# EAGLE board driver_board (EAGLE 6.1)
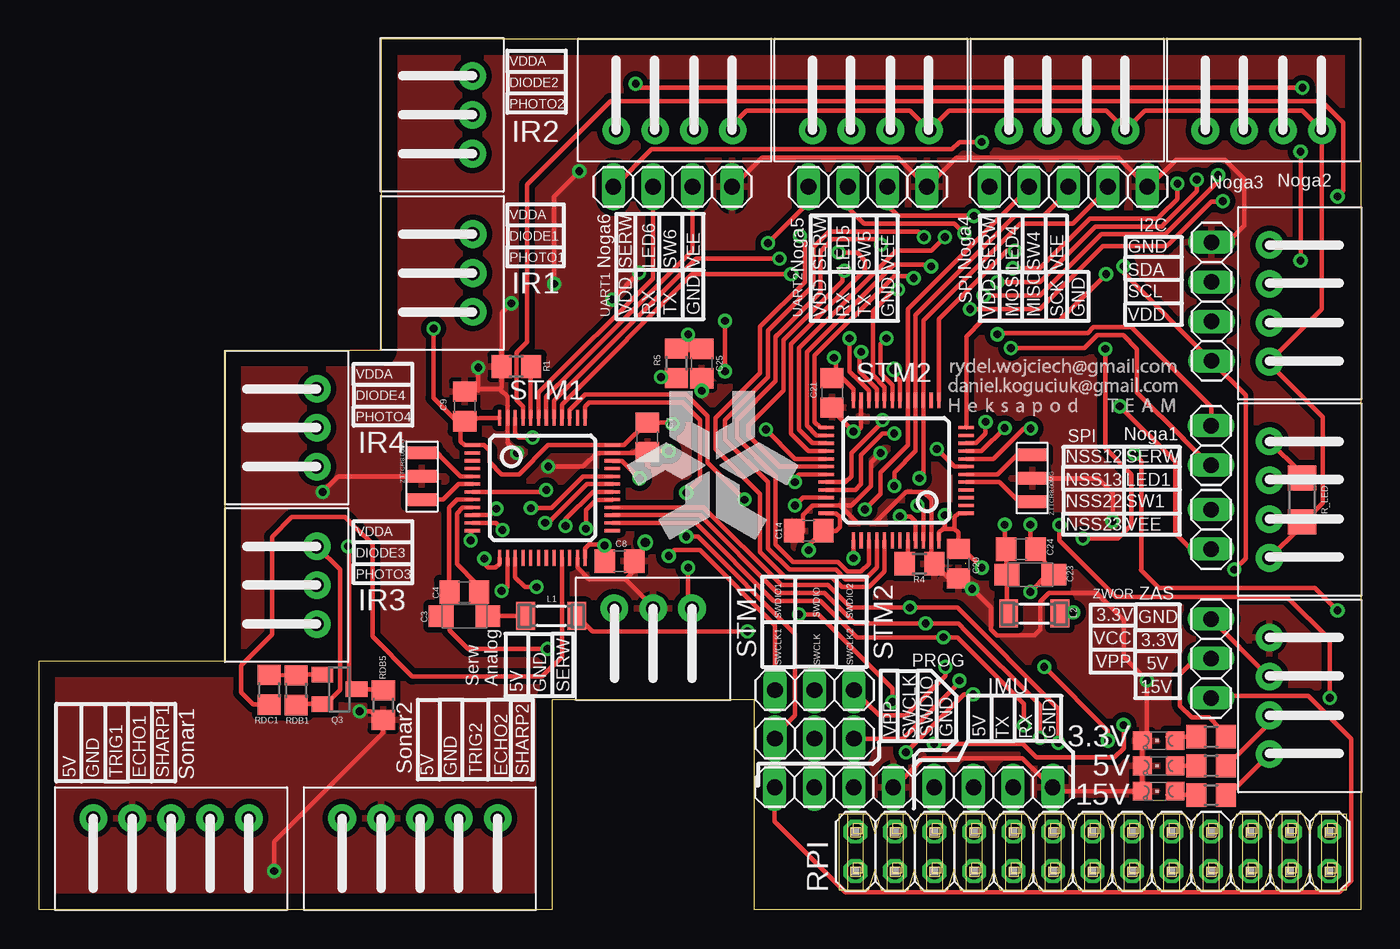
[diagram p7: board, top side]
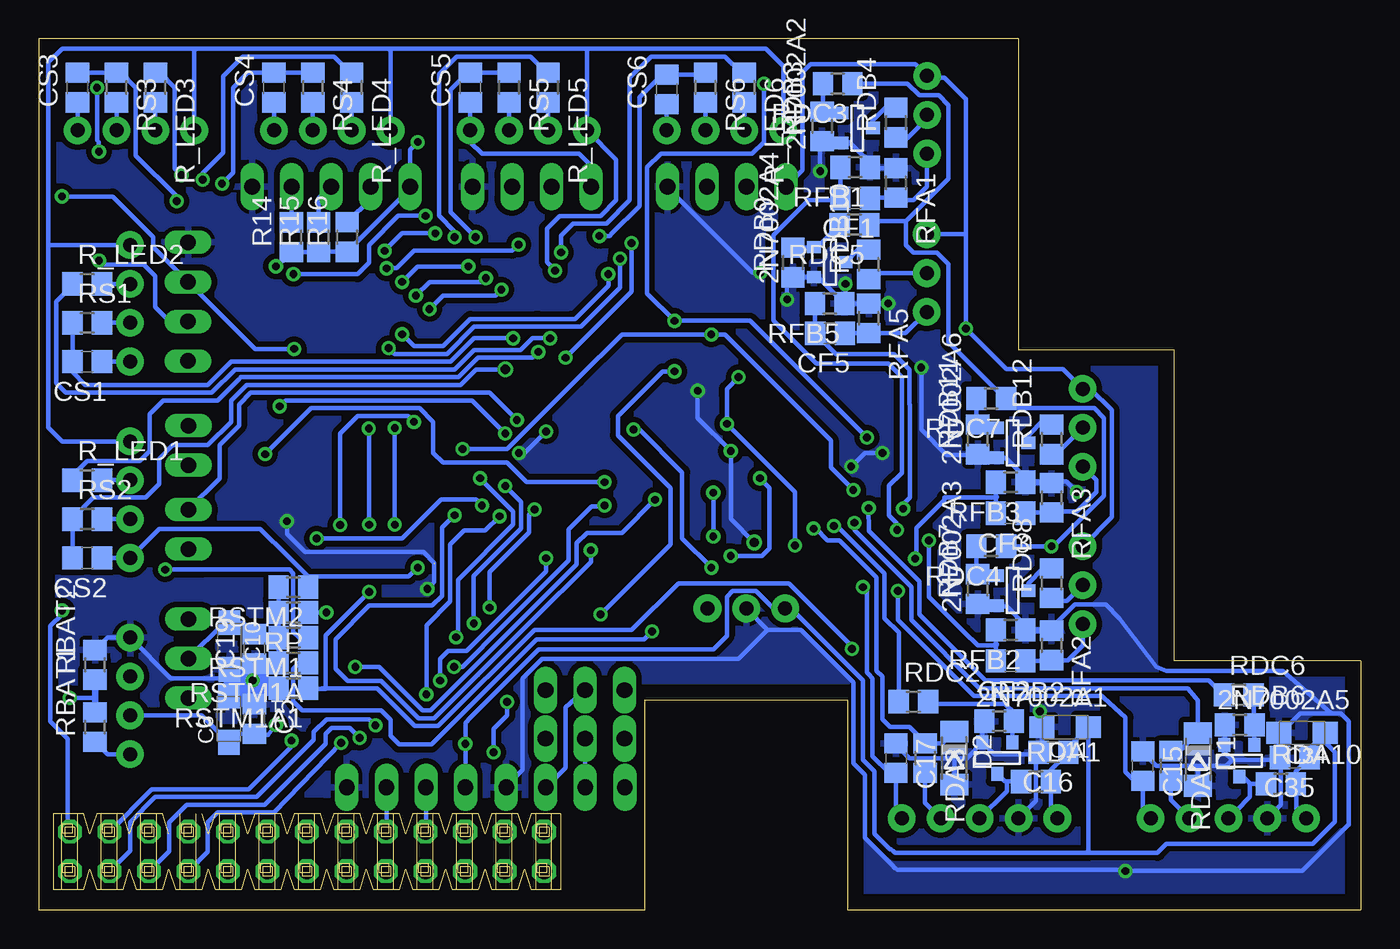
[diagram p8: board, bottom side, seen from below]

Size 84.99 x 56.01 mm. Coordinates in mm from the lower left corner, seen from the top.
Outline: 320 segments
Copper layers (1*16): Top 0.035mm / dielectric 1.5mm / Bottom 0.035mm
Design rules: minimum track width 10mil, minimum drill 24mil, track to track 10mil, track to pad 10mil, pad to pad 10mil, via to via 10mil, smd to smd 0mil, copper to edge 40mil, drill to drill 8mil, minimum pad ring 10mil, minimum via ring 8mil, stop-mask expansion 4mil, vias tented up to drill 0mil, thermal gap 10mil

## Footprints (pad centres in the part's own frame; a part is rotated, then mirrored left to right if it is on the bottom)
SOT-23 = smd 0.787 x 0.889: 1 0.025,-1.016; 2 -0.94,1.016; 3 0.991,1.016
SMC_A = smd 1.6 x 1.4: + -1.5,0; - 1.5,0
C0805 = smd 1.3 x 1.5: 1 -0.95,0; 2 0.95,0
SOD80C = smd 1.4 x 1.8: A 1.7,0; C -1.7,0
TQFP48 = smd 0.2 x 1: 1 -2.75,-4.5; 2 -2.25,-4.5; 3 -1.75,-4.5; 4 -1.25,-4.5; 5 -0.75,-4.5; 6 -0.25,-4.5; 7 0.25,-4.5; 8 0.75,-4.5; 9 1.25,-4.5; 10 1.75,-4.5; 11 2.25,-4.5; 12 2.75,-4.5; 25 2.75,4.5; 26 2.25,4.5; 27 1.75,4.5; 28 1.25,4.5; 29 0.75,4.5; 30 0.25,4.5; 31 -0.25,4.5; 32 -0.75,4.5; 33 -1.25,4.5; 34 -1.75,4.5; 35 -2.25,4.5; 36 -2.75,4.5 | smd 1 x 0.2: 13 4.5,-2.75; 14 4.5,-2.25; 15 4.5,-1.75; 16 4.5,-1.25; 17 4.5,-0.75; 18 4.5,-0.25; 19 4.5,0.25; 20 4.5,0.75; 21 4.5,1.25; 22 4.5,1.75; 23 4.5,2.25; 24 4.5,2.75; 37 -4.5,2.75; 38 -4.5,2.25; 39 -4.5,1.75; 40 -4.5,1.25; 41 -4.5,0.75; 42 -4.5,0.25; 43 -4.5,-0.25; 44 -4.5,-0.75; 45 -4.5,-1.25; 46 -4.5,-1.75; 47 -4.5,-2.25; 48 -4.5,-2.75
1X02 = drill 1.016 long: 1 -1.27,0; 2 1.27,0
1X05 = drill 1.016 long: 1 -5.08,0; 2 -2.54,0; 3 0,0; 4 2.54,0; 5 5.08,0
1X04 = drill 1.016 long: 1 -3.81,0; 2 -1.27,0; 3 1.27,0; 4 3.81,0
2X13 = drill 1.016 octagon: 1 -15.24,-1.27; 2 -15.24,1.27; 3 -12.7,-1.27; 4 -12.7,1.27; 5 -10.16,-1.27; 6 -10.16,1.27; 7 -7.62,-1.27; 8 -7.62,1.27; 9 -5.08,-1.27; 10 -5.08,1.27; 11 -2.54,-1.27; 12 -2.54,1.27; 13 0,-1.27; 14 0,1.27; 15 2.54,-1.27; 16 2.54,1.27; 17 5.08,-1.27; 18 5.08,1.27; 19 7.62,-1.27; 20 7.62,1.27; 21 10.16,-1.27; 22 10.16,1.27; 23 12.7,-1.27; 24 12.7,1.27; 25 15.24,-1.27; 26 15.24,1.27
1X03 = drill 1.016 long: 1 -2.54,0; 2 0,0; 3 2.54,0
SM-1206 = smd 1.2 x 1.8: 1 -1.65,0; 2 1.65,0
CHIPLED_0805 = smd 1.2 x 1.2: A 0,-1.05; C 0,1.05
MOLEX-5268-04 = drill 0.9 pad 1.778: P$1 0,3.75; P$2 0,1.25; P$3 0,-1.25; P$4 0,-3.75
SOT23 = smd 1 x 1.4: 1 -0.95,-1.1; 2 0.95,-1.1; 3 0,1.1
R0805 = smd 1.3 x 1.5: 1 -0.95,0; 2 0.95,0
R1206 = smd 1.6 x 1.803: 1 -1.422,0; 2 1.422,0
MOLEX-5268-05 = drill 0.9 pad 1.778: P$1 0,5; P$2 0,2.5; P$3 0,0; P$4 0,-2.5; P$5 0,-5
MOLEX-5268-03 = drill 0.9 pad 1.778: P$1 0,2.5; P$2 0,0; P$3 0,-2.5
ZTTCR8.00MG = smd 0.8 x 2: GROUND 0,0; INPUT -1.5,0; OUTPUT 1.5,0

## Placement (x,y rotation side)
2N7002A1  [SOT-23]  23.38,9.75 0 bottom
2N7002A2  [SOT-23]  32.38,50.25 90 bottom
2N7002A3  [SOT-23]  22.38,20.5 90 bottom
2N7002A4  [SOT-23]  34.12,41.62 90 bottom
2N7002A5  [SOT-23]  7.82,9.58 0 bottom
2N7002A6  [SOT-23]  22.38,30 90 bottom
C3  1uF  [SMC_A]  27.36,18.88 180 top
C4  10nF  [C0805]  27.36,20.43 180 top
C5  100nF  [C0805]  71.13,12.27 270 bottom
C6  220uF  [SMC_A]  72.77,12.27 90 bottom
C7  100nF  [C0805]  39.12,30.39 270 top
C8  100nF  [C0805]  37.34,22.42 0 top
C9  100nF  [C0805]  27.38,32.37 90 top
C10  220uF  [SMC_A]  72.73,16.96 270 bottom
C11  10uF  [SMC_A]  19,11.75 180 bottom
C14  100nF  [C0805]  49.5,24.38 180 top
C15  100nF  [C0805]  14.01,9.24 270 bottom
C16  100nF  [C0805]  19.75,10.12 180 bottom
C17  100nF  [C0805]  29.88,9.75 270 bottom
C19  100nF  [C0805]  71.12,16.77 90 bottom
C20  100nF  [C0805]  59.12,22.25 270 top
C21  100nF  [C0805]  51,33.25 270 top
C23  1uF  [SMC_A]  63.75,21.55 0 top
C24  10nF  [C0805]  63.15,23.18 0 top
C25  100nF  [C0805]  42.62,35.13 270 top
C34  10uF  [SMC_A]  3.77,11.38 180 bottom
C35  100nF  [C0805]  4.23,9.78 180 bottom
CF1  100nF  [C0805]  32.5,45.75 180 bottom
CF2  100nF  [C0805]  22.5,16 180 bottom
CF3  100nF  [C0805]  22.5,25.5 180 bottom
CF5  100nF  [C0805]  34.12,37.08 180 bottom
CS1  100nF  [C0805]  81.88,35.25 180 bottom
CS2  100nF  [C0805]  81.88,22.62 180 bottom
CS3  100nF  [C0805]  82.5,52.88 90 bottom
CS4  100nF  [C0805]  69.88,52.88 90 bottom
CS5  100nF  [C0805]  57.25,52.88 90 bottom
CS6  100nF  [C0805]  44.62,52.75 90 bottom
D1  2.65V  [SOD80C]  10.46,9.66 270 bottom
D2  2.65V  [SOD80C]  26.12,9.75 270 bottom
IC1  STM32F10XCXT6  [TQFP48]  32.38,27.12 270 top
IC2  STM32F10XCXT6  [TQFP48]  55.12,28.25 90 top
JP1  [1X02]  75.38,29.86 270 top
JP2  [1X05]  66.2,46.5 0 top
JP3  [1X02]  75.38,24.46 270 top
JP5  [1X04]  40.75,46.5 180 top
JP6  [2X13]  67.75,3.75 0 top
JP7  [1X04]  51.12,7.88 180 top
JP8  [1X03]  49.88,11 0 top
JP9  [1X04]  75.4,39.11 270 top
JP10  [1X04]  61.38,7.88 0 top
JP11  [1X03]  75.38,16.15 90 top
JP12  [1X03]  49.88,14.12 0 top
L1  10uH  [SM-1206]  32.94,18.89 0 top
L2  10uH  [SM-1206]  64,19.04 0 top
LED1  [CHIPLED_0805]  72,7.62 90 top
LED2  [CHIPLED_0805]  72,9.25 90 top
LED3  [CHIPLED_0805]  72,10.88 90 top
N1  MOLEX-5268-04  [MOLEX-5268-04]  79.12,26.38 180 top
N2  MOLEX-5268-04  [MOLEX-5268-04]  79.12,39 180 top
N3  MOLEX-5268-04  [MOLEX-5268-04]  78.75,50.12 270 top
N4  MOLEX-5268-04  [MOLEX-5268-04]  66.12,50.12 270 top
N5  MOLEX-5268-04  [MOLEX-5268-04]  53.5,50.12 270 top
N6  MOLEX-5268-04  [MOLEX-5268-04]  40.88,50.12 270 top
Q3  BSS84  [SOT23]  19.34,14.18 270 top
R1  100k  [R0805]  30.7,34.93 180 top
R4  100k  [R0805]  56.62,22.25 0 top
R5  100k  [R0805]  41,35.14 90 top
R14  10k  [R0805]  68.75,43.25 90 bottom
R15  10k  [R0805]  67,43.25 90 bottom
R16  10k  [R0805]  65.17,43.27 90 bottom
R_LED1  68  [R0805]  81.88,27.62 0 bottom
R_LED2  68  [R0805]  81.88,40.25 0 bottom
R_LED3  68  [R0805]  77.5,52.88 270 bottom
R_LED4  68  [R0805]  64.88,52.88 270 bottom
R_LED5  68  [R0805]  52.25,52.88 270 bottom
R_LED6  68  [R0805]  39.62,52.88 270 bottom
R_LED7  10k  [R1206]  81.22,26.35 270 top
RBAT1  12k  [R0805]  81.38,11.75 90 bottom
RBAT2  3k  [R0805]  81.38,15.75 90 bottom
RDA1  10k  [R0805]  20.88,8.25 0 bottom
RDA2  1k  [R0805]  12.21,9.26 270 bottom
RDA3  1k  [R0805]  28,9.75 270 bottom
RDA10  10k  [R0805]  5.12,8.1 0 bottom
RDB1  47k  [R0805]  16.55,14.12 270 top
RDB2  47k  [R0805]  23.25,12.12 0 bottom
RDB3  47k  [R0805]  34.62,50.38 90 bottom
RDB4  12R  [R0805]  29.88,50.62 90 bottom
RDB5  47k  [R0805]  22.14,13.15 270 top
RDB6  47k  [R0805]  7.78,11.89 0 bottom
RDB7  47k  [R0805]  24.62,20.62 90 bottom
RDB8  12R  [R0805]  19.88,21 90 bottom
RDB9  47k  [R0805]  36.5,41.62 90 bottom
RDB10  12R  [R0805]  31.62,41.5 90 bottom
RDB11  47k  [R0805]  24.62,30.25 90 bottom
RDB12  12R  [R0805]  19.88,30.25 90 bottom
RDC1  330R  [R0805]  14.8,14.14 90 top
RDC2  330R  [R0805]  28.75,13.38 0 bottom
RDC3  330R  [R0805]  33.62,53.12 180 bottom
RDC4  330R  [R0805]  23.75,23.38 180 bottom
RDC5  330R  [R0805]  32.54,44.05 180 bottom
RDC6  330R  [R0805]  7.83,13.82 0 bottom
RDC7  330R  [R0805]  23.75,32.88 180 bottom
RFA1  1k  [R0805]  29.88,46.75 270 bottom
RFA2  1k  [R0805]  19.88,17 270 bottom
RFA3  1k  [R0805]  19.88,26.5 270 bottom
RFA5  1k  [R0805]  31.63,38.03 270 bottom
RFB1  100k  [R0805]  32.5,47.75 180 bottom
RFB2  100k  [R0805]  22.5,18 180 bottom
RFB3  100k  [R0805]  22.5,27.5 180 bottom
RFB5  100k  [R0805]  34.13,38.98 180 bottom
RP  0  [R0805]  68.62,19.12 180 bottom
RS1  100R  [R0805]  81.88,37.75 0 bottom
RS2  100R  [R0805]  81.88,25.12 0 bottom
RS3  100R  [R0805]  80,52.88 270 bottom
RS4  100R  [R0805]  67.38,52.88 270 bottom
RS5  100R  [R0805]  54.75,52.88 270 bottom
RS6  100R  [R0805]  42.12,52.88 270 bottom
RSTM1  0  [R0805]  68.62,17.5 180 bottom
RSTM1A  0  [R0805]  68.62,15.88 180 bottom
RSTM1A1  0  [R0805]  68.62,14.25 180 bottom
RSTM2  0  [R0805]  68.62,20.75 180 bottom
RSTM3  1k  [R0805]  75.38,7.38 180 top
RSTM4  270  [R0805]  75.38,9.25 180 top
RSTM5  150  [R0805]  75.38,11.12 180 top
SS1  MOLEX-5268-05  [MOLEX-5268-05]  8.5,5.88 90 top
SS2  MOLEX-5268-05  [MOLEX-5268-05]  24.5,5.88 90 top
U$1  MOLEX-5268-03  [MOLEX-5268-03]  39.5,19.38 90 top
U$2  MOLEX-5268-04  [MOLEX-5268-04]  79.12,13.75 180 top
U$3  MOLEX-5268-03  [MOLEX-5268-03]  27.89,40.95 0 top
U$4  MOLEX-5268-03  [MOLEX-5268-03]  27.88,51.12 0 top
U$5  MOLEX-5268-03  [MOLEX-5268-03]  17.88,20.88 0 top
U$6  MOLEX-5268-03  [MOLEX-5268-03]  17.88,31 0 top
U$7  ZTTCR8.00MG  [ZTTCR8.00MG]  24.62,27.88 270 top
U$8  ZTTCR8.00MG  [ZTTCR8.00MG]  63.88,27.75 90 top
USART  [1X04]  53.3,46.5 180 top

## Tracks (layer width: path | path; a pad name or v marks a point on that pad's centre or on a via)
+3V3
  Top 0.305: JP11.3 79.06,15 U$2.P$3
+5V  (via drill 0.5)
  Top 0.305: RSTM4.1 76.38,9.25 79.12,12 U$2.P$2 | v69.75,11.88 69.75,10.38 69.17,9.79 64.15,9.79 63.27,10.67 v57.56,10.67
  Bottom 0.305: SS1.P$1 4.12,6.5 4.12,8.12 4.14,8.12 RDA10.2 4.17,8.88 C35.1 3.28,10.37 C34.+ 2.27,10.76 1.67,10.16 1.67,5.66 3.07,4.25 12.48,4.25 13.07,3.66 17.5,3.66 17.5,3.78 | SS2.P$1 19.93,6.3 RDA1.2 19.93,9 C16.1 18.8,10.45 C11.+ 17.5,3.78 | 79.06,12.44 U$2.P$2 74.5,12.5 C6.+ 72.22,11.32 C5.2 71.06,11.25 70.25,11.25 v69.75,11.88 | 17.63,3.65 29.93,3.65 30.06,3.78 30.08,3.78 30.19,3.89 30.26,3.89 31.25,4.88 31.25,8.89 32.01,9.65 32.01,14.74 32,14.75 36.62,19.38 U$1.P$1 37.75,19.38 38.88,20.5 40.38,20.5 40.75,20.12 40.75,17.62 41.62,16.75 52.88,16.75 57.4,12.22 57.4,12.19 57.56,12.03 v57.56,10.67 JP10.1 57.56,7.54 | 17.63,3.65 17.5,3.78 | 17.63,3.65 17.54,3.65 17.5,3.69
+15V
  Top 0.305: RSTM3.1 76.5,7.38 U$2.P$1
  Bottom 0.305: RBAT1.1 80.58,10 U$2.P$1
AGND  (via drill 0.5)
  Top 0.305: IC1.8 27.12,26.38 26.88,26.38 | 26.38,20.4 26.38,25.62 26.38,25.87 26.88,26.38 | 26.38,20.4 26.38,20.25 | 26.41,19.42 C4.2 26.38,20.4 | 26.41,19.42 C3.- | 26.41,19.42 26.41,17.97 27.59,16.79 31.86,16.79 32.31,16.78 v32.7,16.77 | C24.2 C23.- 64.86,21.55 v63.75,20.45 | IC2.8 61.38,29 63.33,30.96 v63.78,30.96 | 26.88,26.38 26.67,26.16 | 64.01,23.24 64.01,23.11 64.07,23.18 C24.2 | v63.75,24.77 63.75,23.52 C24.2
  Bottom 0.305: 67.75,14.18 RSTM1A1.1 67.63,14.2 66.55,14.2 | v32.7,16.77 32.7,16.95 36.75,21 43.88,21 46.88,18 53.12,18 59.31,11.81 60.83,11.81 63.25,14.22 63.63,14.22 | 66.55,14.22 66.55,14.2 | 63.5,14.22 63.63,14.22 | 63.63,14.22 66.55,14.22 | 66.55,14.22 66.8,14.22 | 66.55,14.2 66.55,14.22 | v63.78,30.96 63.75,30.93 v63.75,24.77 | 66.55,14.22 66.55,17.65 v63.75,20.45
DIODE1
  Bottom 0.305: U$3.P$2 31.23,40.95 RDB10.1
DIODE2
  Bottom 0.305: U$4.P$2 27.88,50.88 29.12,49.62 29.82,49.62 RDB4.1
DIODE3
  Bottom 0.305: 19.7,19.88 18.88,19.88 U$5.P$2
  Bottom 0.406: 19.7,19.88 RDB8.1
DIODE4
  Bottom 0.305: RDB12.1 19.57,29.3 U$6.P$2
ECHO1
  Bottom 0.305: SS1.P$4 12.21,7.08 RDA2.2
ECHO2
  Bottom 0.305: RDA3.2 28,6.88 SS2.P$4
GND  (via drill 0.5, 0.6)  (1 unrouted)
  Top 0.305: 38.38,22.25 38.38,22.68 C8.2 v39,23.62 | C14.2 49.12,24.3 49.12,25.38 49.75,26 IC2.35 51.5,26 | 28.38,33.5 28.25,33.5 | 28.25,33.5 28.12,33.38 | 29.62,33.5 29.75,33.63 R1.2 29.75,38.38 v30.38,39 | 28.25,33.5 28.25,33.45 C9.2 | 44.62,46.5 46.5,48.38 55.25,48.38 57.11,46.52 USART.1 57.12,46.5 59,48.38 69.41,48.38 JP2.5 71.38,46.5 73.12,48.25 76.25,48.25 77.5,47 77.5,44 76.38,42.88 76.33,42.92 JP9.1 | JP7.1 55,7.88 56.88,9.75 63.25,9.75 65.12,7.88 JP10.4 65.44,7.62 LED1.C LED2.C LED3.C 71.25,11.18 v71.25,14.75 69.75,16.25 69.75,18.62 68,20.38 64.95,20.38 64.39,19.81 64.39,18.03 64.01,17.65 61.59,17.65 61.21,18.03 61.21,19.43 v60.01,20.63 59.34,21.3 C20.2 | C20.2 58.52,21.3 R4.2 57.38,22.45 IC2.47 57.38,26.38 56.88,26.88 55.75,26.88 53.75,24.88 52.62,24.88 51.5,26 | v40.5,29.5 39.18,29.5 C7.2 38.31,29.44 38.25,29.38 IC1.35 35.88,29.38 35,28.5 v32.75,28.5 | C21.2 51,32.12 v52.38,30.75 52.62,30.75 52.88,31 IC2.23 | 51.5,26 52.25,26 53.5,27.25 53.5,28.75 v54.12,29.38 | 29.62,33.5 30.12,33 IC1.47 30.12,30 v30.75,29.38 | 29.62,33.5 28.38,33.5 | 28.38,33.5 28.25,33.38 v28.25,34.88 | IC1.23 34.62,22 35.38,21.25 37.73,21.25 | v69.04,24.98 69.07,25.01 69.07,26.81 68.12,27.75 U$8.GROUND | v36.88,39.25 v38.6,40.97 v38.6,40.98 | 22.12,12.12 22.12,11.38 15.12,4.38 v15.12,2.5 | 22.12,12.12 22,12.12 21.38,12.75 v20.62,12.75 | RDB5.2 22.14,12.14 22.12,12.12 | v42.62,33.38 C25.2 | 59.38,21.12 59.2,21.3 C20.2 | v34.75,47.5 33.12,45.88 v33.12,40.25 | v18.25,26.88 19.25,27.88 U$7.GROUND | 37.73,21.25 38.33,21.84 38.33,22.43 38.35,22.45 | U$1.P$2 39.5,19.48 37.73,21.25
  Bottom 0.305: 5.13,10.26 5.25,10.38 5.22,10.4 C35.2 | C34.- 5.27,9.88 | 5.27,9.88 5.27,9.77 5.25,9.75 | RDB6.1 8.72,10.63 2N7002A5.2 8.76,10.13 8.25,9.62 | 8.25,9.62 5.33,9.62 C35.2 | C35.2 5.27,9.88 | C15.1 14.07,10.2 13.12,9.25 10.38,9.25 | 10.38,9.25 8.62,9.25 8.25,9.62 | D1.A 10.46,9.17 10.38,9.25 | 5.12,9.75 5.15,9.75 C35.2 | 20.88,10 20.75,10.12 C16.2 20.5,10.32 C11.- 20.62,11.88 v20.62,12.75 | 20.88,10 23.55,10 2N7002A1.2 | 2N7002A1.2 24.32,12.01 RDB2.1 | C17.1 29.88,10.62 29,9.75 26.12,9.75 | 26.12,9.75 25.33,9.75 2N7002A1.2 | RFA1.1 31.5,47.7 | 31.55,47.7 31.62,47.62 31.62,48.12 32.88,49.38 34.62,49.38 34.75,49.25 v34.75,47.5 | RDB3.1 33.51,49.42 | 2N7002A2.2 32.81,49.31 31.88,48.38 | 31.88,48.08 RFB1.1 | 21.55,18.3 22.75,19.5 23.33,19.5 2N7002A3.2 24.51,19.56 | RFA3.1 21.32,27.45 | 5.12,11.38 3.88,12.62 1.88,12.62 | 1.88,12.62 1.28,12.62 0.77,12.12 0.77,5.47 | SS1.P$2 5.12,6.75 5.12,9.75 | 5.12,9.75 5.25,9.62 | SS2.P$2 20.88,7 20.88,10 | D2.A 26.12,9.75 | 38.12,18 36,18 32.62,14.62 32.62,9.42 31.89,8.68 31.89,4.61 30.15,2.88 30.13,2.88 29.93,2.68 29.91,2.68 29.8,2.57 15.2,2.57 v15.12,2.49 3.76,2.49 0.75,5.5 | 38.12,18 U$1.P$2 | RBAT2.2 80.58,17.5 U$2.P$4 76.5,14.88 72.77,14.88 | 72.73,16.11 C10.- | C10.- 72.77,15.42 72.77,14.88 | 72.77,14.88 C6.- 72.22,13.22 C5.1 70.1,14.25 | C10.- 72.37,15.82 72,15.82 | 72,15.82 C19.1 71.12,15.75 71,15.88 | 70.1,14.25 RSTM1A1.2 69.7,14.38 69.75,14.38 | 71.88,15.62 72,15.75 72,15.82 | 70.88,14.75 v71.25,14.75 70.6,14.75 70.1,14.25 | JP7.1 55,7.88 53.88,9 53.88,14.88 52.62,16.12 40,16.12 38.12,18 | RFB5.1 RFA5.1 30.39,38.98 v30.38,39 | RFB5.1 33.12,39.04 v33.12,40.25 | v36.88,39.25 36.88,40.3 RDB9.1 36.49,40.69 2N7002A4.2 34.89,40.69 RFB5.1
  Bottom 0.305: RFA2.1 19.88,18.12 18.38,19.62 16.38,19.62 15.5,18.75 13.12,15.62 12.5,15.38 5,15.38 1.88,12.62 | v18.25,26.88 18.93,27.55 21.68,27.55 21.75,27.62 21.75,27.7 21.75,28 22.81,29.06 2N7002A6.2 23.63,29.3 RDB11.1 24.68,29.25 26.62,29.25 28.25,30.88 v28.25,34.88 | v52.38,30.75 53.75,29.38 v54.12,29.38 | v30.75,29.38 31.88,29.38 v32.75,28.5 | v69.04,24.98 69.04,24.16 67.88,23 60.26,23 59.56,22.3 | v38.6,40.98 39.11,40.98 44.62,46.5 | v42.62,33.38 42.62,31.62 v40.5,29.5 40.5,25.12 v39,23.62 | v60.01,20.63 59.69,20.95 59.56,21.08 59.56,22.23
  Bottom 0.406: 31.55,47.7 31.5,47.7 RFB1.1 | 33.51,49.42 2N7002A2.2 | 31.88,48.38 31.88,48.08 | 21.55,18.3 RFB2.1 21.5,17.95 RFA2.1 | 24.51,19.56 RDB7.1 | 21.32,27.45 21.44,27.56 | 21.44,27.56 21.5,27.62 | 21.75,27.7 RFB3.1 21.5,27.5 21.44,27.56 | C34.- 5.12,11.38 | C11.- 20.38,11.75
  Bottom 1.27: 69.62,14.38 69.75,14.38 72.5,14.38 | 71.88,15.62 71.88,13.88 | 71,15.88 71,13.5
  pour Bottom (isolate 0.356): 0,0 33.02,0 33.02,13.46 45.97,13.46 45.97,0 84.84,0 84.84,55.88 22.1,55.88 22.1,35.81 12.19,35.81 12.19,16 0,16
  pour Top (isolate 0.356): 0,0 33.02,0 33.02,13.46 45.97,13.46 45.97,0 84.84,0 84.84,55.88 22.1,55.88 22.1,35.81 12.19,35.94 12.19,16.13 0,16
I2C_SCL  (via drill 0.5)
  Top 0.305: IC1.46 30.62,30.62 30.88,30.38 v31.75,30.38 | IC2.45 56.38,24.38 56.36,24.39 56.36,24.97 56.03,25.31 v55.37,25.31 | v55.75,10.12 57.75,12.12 59.47,13.84 v60.07,13.84 | v54.88,13.38 54.88,14.25 50.12,19 v48.88,19 | v81.12,41.75 v81.12,48.75 | v81.25,52.88 38.62,52.88 v38.38,53.12 | v44.12,34.62 v44.12,37.88
  Bottom 0.305: v55.75,10.12 55.75,11.62 54.88,12.5 v54.88,13.38 | v48.88,19 44.38,23.5 44.38,27.12 47.75,30.5 47.75,31.75 44.88,34.62 v44.12,34.62 | JP9.3 76.59,37.84 77.5,38.75 77.5,40.75 78.25,41.5 80.88,41.5 v81.12,41.75 | v81.12,48.75 81.12,49.38 81.25,49.5 v81.25,52.88 | v38.38,53.12 38.38,50.88 38.38,49.38 39.12,48.62 40,48.62 42.75,48.62 45,48.62 45.88,47.75 45.88,39.62 v44.12,37.88 39.25,37.88 v31.75,30.38 | v55.37,25.31 56.29,24.38 57.66,24.38 58.55,23.5 58.55,19.81 60.07,18.29 v60.07,13.84
I2C_SDA  (via drill 0.5)
  Top 0.305: IC2.46 56.88,25.75 56.62,26 v56.5,26 | IC1.45 31.12,32.38 30.71,32.79 30.71,35.83 31.38,36.5 31.38,46.62 36.75,52 82.5,52 83.88,50.62 83.88,46.25 v83.5,45.88 | v67.12,23.88 69.38,23.88 70.25,24.75 70.25,27.93 70.25,28 68.62,29.62 68.58,29.67 v68.58,36.07
  Bottom 0.305: v56.5,26 56.88,26.38 59.12,26.38 61.62,23.88 61.63,23.88 v67.12,23.88 | v83.5,45.88 80.25,45.88 77.62,43.25 77.62,42.6 JP9.2 71.12,36.1 71.09,36.07 v68.58,36.07
IMU_RX
  Bottom 0.305: JP6.10 62.65,5.04 JP10.3
IMU_TX
  Bottom 0.305: JP6.8 60.1,5.04 JP10.2
IR_ENABLE  (via drill 0.5)
  Top 0.305: RDB5.1 22.07,14.18 Q3.3 20.43,14.18 20.38,14.12 20.38,14.25 19.93,14.69 19.93,23.31 v19.88,23.38
  Bottom 0.305: RDC4.1 v19.88,23.38 19.75,23.38 16.5,26.62 16.5,31.62 17.12,32.25 22.18,32.25 RDC7.1 22.88,32.88 26.38,36.38 26.51,36.5 26.51,41.51 27.25,42.25 28.75,42.25 29.25,42.75 29.25,44.27 | RDC3.1 29.12,53.12 28.38,52.38 27.12,52.38 26.5,51.75 26.5,47.02 29.25,44.27 | RDC5.1 31.37,44.27 29.25,44.27
IR_RECEIVE1  (via drill 0.5)
  Top 0.305: IC1.10 29,25.38 v29.41,25.79
  Bottom 0.305: RFB5.2 35.09,37.1 | 35.09,37.1 CF5.2 | v29.41,25.79 29.41,26.09 28.99,26.52 28.99,32.49 29,32.5 29,34.75 30,35.75 33.75,35.75 35.12,37.12 35.1,37.1 35.09,37.1
IR_RECEIVE2  (via drill 0.5)
  Top 0.305: v29.8,24.43 29.8,24.45 29.39,24.87 IC1.11
  Bottom 0.305: RFB1.2 CF1.2 33.58,45.62 35.5,45.62 37.75,43.38 37.75,37.88 35,35.12 30.38,35.12 29.5,34.25 29.5,28.09 30.32,27.27 30.32,25.36 29.8,24.85 v29.8,24.43
IR_RECEIVE3  (via drill 0.5)
  Top 0.305: v27.75,23.75 27.75,24.12 IC1.12
  Bottom 0.305: RFB2.2 23.45,17.05 | CF2.2 23.45,16.95 23.5,17 24.62,17 25.5,17.88 27.75,20.12 v27.75,23.75
  Bottom 0.406: 23.45,17.05 23.5,17
IR_RECEIVE4  (via drill 0.5)
  Top 0.305: IC1.13 29.62,22.25 29.38,22 29.12,22 28.88,22 28.64,22.23 v28.64,22.57
  Bottom 0.305: RFB3.2 23.45,26.55 CF3.2 | 23.5,26.5 26.75,26.5 26.75,26.36 28.55,24.56 28.55,22.67 v28.64,22.57
  Bottom 0.406: 23.45,26.55 23.5,26.5
IR_TRANSMIT
  Top 0.305: 14.8,12.7 RDC1.1 13.79,13.2 13,13.99 13,15.73 15,17.72 15,23.99 16.26,25.25 19.68,25.25 20.41,24.53 20.44,24.53 21.45,23.52 21.45,17.57 24.01,15 32.36,15 33.62,16.26 IC1.21
LED1  (via drill 0.5)
  Top 0.305: IC2.21 53.88,33.5 52.75,34.62 52.75,35.75 v52.88,35.88
  Bottom 0.305: R_LED1.1 82.83,27.93 81.88,28.88 78.5,28.88 77.88,29.5 77.88,31.88 77,32.75 73.5,32.75 72.12,34.12 72,34.25 58,34.25 56.75,35.5 53.25,35.5 v52.88,35.88
LED2  (via drill 0.5)
  Top 0.305: IC2.22 53.38,33.38 52.75,34 52.12,34.62 v52.12,36.75
  Bottom 0.305: R_LED2.1 82.83,40.17 83.88,39.12 83.88,33.88 83.38,33.38 83.25,33.25 77.62,33.25 73.88,33.25 72.38,34.75 58.25,34.75 57,36 54.75,36 54.62,36 54,36 53.25,36.75 v52.12,36.75
LED3  (via drill 0.5)
  Top 0.305: IC2.25 50.25,31 49.88,31.38 49.88,35.62 54.88,40.62 54.99,40.74 56.13,40.74 v56.25,40.63 v56.25,40.62 | v60.75,39.5 64.38,39.5 64.62,39.75 68.31,43.43 69.09,43.43 | 69.09,43.43 72.43,43.43 72.5,43.5 75.62,46.62 75.82,46.82 v75.82,47.24 | 69.09,43.43 68.33,43.43
  Bottom 0.305: R_LED3.1 77.2,53.83 76.25,52.88 76.25,48.5 76.25,47.67 v75.82,47.24 | v56.25,40.62 56.5,40.38 59.88,40.38 v60.75,39.5
LED4  (via drill 0.5)
  Top 0.305: IC2.26 50,30.5 49.38,31.12 49.38,35.88 54.98,41.48 57.27,41.48 v57.38,41.38 | v61.62,40.38 64.38,40.38 67.94,43.94 68.58,43.94 | v74.45,46.95 74.45,46.2 72.38,44.12 72.19,43.94 68.58,43.94 | 68.58,43.94 68.07,43.94
  Bottom 0.305: R_LED4.1 64.95,53.83 66,54.88 71.88,54.88 73.14,53.61 73.14,48.68 74.45,47.37 v74.45,46.95 | v61.62,40.38 60.62,41.38 v57.38,41.38
LED5  (via drill 0.5)
  Top 0.305: IC2.27 49.75,30 48.88,30.88 48.88,36.12 54.62,41.88 54.88,42.12 55.12,42.38 57.38,42.38 v58.25,43.25
  Bottom 0.305: R_LED5.1 52.33,53.83 53.38,54.88 58.12,54.88 58.75,54.25 59.06,53.94 | 59.25,53.75 59.06,53.94 | 59.25,53.75 59.25,45.12 59.25,44.62 58.25,43.62 v58.25,43.25 | 59.25,53.75 59.06,53.94
LED6  (via drill 0.5)
  Top 0.305: IC2.28 49.5,29.5 48.38,30.62 48.38,36.38 53.06,41.06 53.12,41.12 53.12,41.75 52.62,42.25 51.44,42.25 v51.41,42.28
  Bottom 0.305: R_LED6.1 39.83,53.83 40.88,54.88 45.62,54.88 47,53.5 47,45.62 48.5,44.12 50.65,44.12 51.42,43.36 v51.42,42.28 v51.41,42.28
N$1
  Top 0.305: Q3.1 16.75,15.12 16.62,15 16.61,15 RDB1.1 16.23,15.06 RDC1.2
N$2
  Bottom 0.305: RDB6.2 2N7002A5.3 | RDC6.2 6.88,11.95
  Bottom 0.406: 6.88,11.95 RDB6.2
N$3
  Bottom 0.305: RDC3.2 34.58,51.38 | 2N7002A2.3 34.54,51.24
  Bottom 0.406: 34.58,51.38 RDB3.2 34.54,51.24
N$4
  Top 0.305: R1.1 31.62,34.9 IC1.44
N$5
  Top 0.305: IC1.9 27.25,25.88 26.88,25.5 26.88,22.25 28.12,21 28.12,20.61 C4.1 28.3,19.44 C3.+ 29,18.88 29.02,18.89 L1.1
N$6  (via drill 0.5)
  Top 0.305: IC2.9 60.62,29.5 v62.1,30.99 | v62.1,24.77 62.1,23.37 62.23,23.24 62.23,23.21 C24.1 C23.+ 62.25,19.33 62.38,19.2 62.23,19.05 62.24,19.04 L2.1
  Bottom 0.305: v62.1,30.99 v62.1,24.77
N$7
  Top 0.305: IC2.44 55.88,22.45 R4.1
N$8
  Bottom 0.305: RDB4.2 30.55,51.58 31.38,50.75 31.38,50.29 2N7002A2.1
N$9
  Bottom 0.305: 2N7002A1.3 22.38,12.04 RDB2.2 22.25,12.18 22.25,12.75 22.38,12.75 22.75,13.12 22.88,13.25 27.43,13.25 RDC2.2
N$10
  Bottom 0.305: RDC4.2 24.7,21.65 RDB7.2
  Bottom 0.406: 2N7002A3.3 24.54,21.49 RDB7.2
N$11
  Bottom 0.305: RDB8.2 20.43,21.95 21.38,21 21.38,20.54 2N7002A3.1
N$12
  Bottom 0.305: RDB9.2 35.3,42.58 35.12,42.75 35.12,42.63 2N7002A4.3 34.93,42.62 RDC5.2
N$13
  Bottom 0.305: RDB10.2 32.31,42.45 2N7002A4.1
N$14
  Bottom 0.305: RDC7.2 24.7,31.27 RDB11.2
  Bottom 0.406: 2N7002A6.3 24.42,30.99 RDB11.2
N$15
  Bottom 0.305: RDB12.2 20.43,31.45 21.38,30.5 21.38,30.04 2N7002A6.1
N$16
  Top 0.305: RSTM4.2 LED2.A
N$17
  Top 0.305: RSTM5.2 72.55,11.12 LED3.A
N$18
  Top 0.305: RSTM3.2 72.55,7.38 LED1.A
N$24  (via drill 0.5)
  other vias: 39,23.62
N$35  (via drill 0.5)
  other vias: 55,34.75
N$42  (via drill 0.5)
  other vias: 52.38,30.75
N$43  (via drill 0.5)
  other vias: 48.62,27.5
N$45  (via drill 0.5)
  other vias: 40.75,31.25
N$47  (via drill 0.5)
  other vias: 40.5,29.5
N$48  (via drill 0.5)
  other vias: 54.25,31.5
N$50  (via drill 0.5)
  other vias: 55,30.62
OSC_IN1
  Top 0.305: IC1.5 27.12,27.88 26,29 25.62,29.38 U$7.INPUT
OSC_IN2
  Top 0.305: IC2.5 61.75,27.5 63,26.25 U$8.INPUT
OSC_OUT1
  Top 0.305: IC1.6 27,27.38 26,26.38 U$7.OUTPUT
OSC_OUT2
  Top 0.305: IC2.6 61.62,28 62.88,29.25 U$8.OUTPUT
P_LED1
  Bottom 0.305: R_LED1.2 N1.P$3
P_LED2
  Bottom 0.305: N2.P$3 R_LED2.2
P_LED3
  Bottom 0.305: N3.P$3 R_LED3.2
P_LED4
  Bottom 0.305: R_LED4.2 N4.P$3
P_LED5
  Bottom 0.305: R_LED5.2 N5.P$3
P_LED6
  Bottom 0.305: R_LED6.2 N6.P$3
P_SWITCH1
  Bottom 0.305: N1.P$2 RS2.2
P_SWITCH2
  Bottom 0.305: N2.P$2 RS1.2
P_SWITCH3
  Bottom 0.305: RS3.2 N3.P$2
P_SWITCH4
  Bottom 0.305: RS4.2 N4.P$2
P_SWITCH5
  Bottom 0.305: RS5.2 N5.P$2
P_SWITCH6
  Bottom 0.305: RS6.2 N6.P$2
PHOTO1
  Bottom 0.305: CF5.1 RFA5.2 29.26,37.08 U$3.P$3
PHOTO2
  Bottom 0.305: 31.5,45.8 RFA1.2 29.88,45.75 29.75,45.62 28.75,45.62 27.88,46.5 U$4.P$3
  Bottom 0.406: 31.5,45.8 CF1.1
PHOTO3
  Bottom 0.305: U$5.P$3 17.88,17 18.82,16.05 RFA2.2 19.93,16 CF2.1
PHOTO4
  Bottom 0.305: 21.5,25.55 RFA3.2 19.8,25.62 18.25,25.62 17,26.88 17,27.62 U$6.P$3
  Bottom 0.406: 21.5,25.55 CF3.1
POZIOM_BATERII  (via drill 0.5)
  Top 0.305: IC2.10 60.25,30 60.88,30.62 v60.88,31.38 | v83,13.62 83,17.38 80.25,20.12 69.25,20.12 65.62,23.75 v65.62,24.75
  Bottom 0.305: v83,13.62 81.38,13.62 | v65.62,24.75 65.62,30.62 64.5,31.75 61.25,31.75 v60.88,31.38
  Bottom 0.406: RBAT1.2 81.38,13.62 RBAT2.1
RESET  (via drill 0.5)
  Top 0.305: v41.75,37 41.75,36.12 41.25,36.12 41.12,36 | C25.1 42.54,36 41.12,36 | 41.12,36 41.04,36.09 R5.2 | IC2.7 58.88,28.5 v57.75,29.62 | v32.62,27 32.5,26.88 IC1.7
  Bottom 0.305: v57.75,29.62 57.38,29.62 54.88,29.62 50.38,34.12 47.5,37 v41.75,37 40.88,37 39.25,35.38 34.12,30.25 34.06,30.19 34.06,28.44 v32.62,27
SERWO  (via drill 0.5)
  Top 0.305: N1.P$4 81.09,28.16 R_LED7.1 | IC2.30 47.62,28.5 45.62,30.5 45.62,31.12 47.88,33.38 47.88,36.63 51.66,40.42 51.66,40.98 v51.8,41.11
  Bottom 0.305: N6.P$4 37.12,54.25 38.25,55.38 49.75,55.38 | N3.P$4 75,55.25 74.88,55.38 | 49.75,55.38 62.5,55.38 | 62.5,55.38 74.88,55.38 | 49.75,55.38 N5.P$4 47.88,48.25 47.88,45.62 48.88,44.62 51.52,44.62 52.32,43.81 52.32,41.63 v51.8,41.11 | N4.P$4 62.38,55.25 62.5,55.38 | 74.88,55.38 83.5,55.38 84.38,54.5 84.38,42.75 | N1.P$4 83.5,30.12 84.38,31 84.38,42.75 | N2.P$4 84.38,42.75
SERWO_ANALOGOWE  (via drill 0.5)
  Top 0.305: U$1.P$3 41.75,19.62 v41.75,22 | v46.75,30.88 48.62,29 IC2.29
  Bottom 0.305: v41.75,22 43.62,23.88 43.62,28.12 46.38,30.88 v46.75,30.88
SHARP1  (via drill 0.5)
  Top 0.305: v29.75,20.5 30.12,20.75 30.12,21.25 IC1.14
  Bottom 0.305: SS1.P$5 14,6.38 14,8.25 14.01,8.26 C15.2 14.54,8.29 15.12,8.88 15.12,12.38 16.5,13.62 16.62,13.75 24.88,13.75 29.62,18.5 29.75,18.62 v29.75,20.5
SHARP2  (via drill 0.5)
  Top 0.305: IC1.15 30.62,22.12 30.62,21.38 31.25,20.75 v32,20.75
  Bottom 0.305: SS2.P$5 29.88,6.25 C17.2 30.3,8.8 31.38,9.88 31.38,14.88 31.62,15.12 31.75,15.25 31.75,15.62 31.75,20.5 v32,20.75
SONAR_ECHO_1  (via drill 0.5)
  Top 0.305: IC1.31 35.25,27.38 33.01,25.14 32.76,24.88 v32.54,24.88
  Bottom 0.305: RDA2.1 11.62,10.21 D1.C 10.46,13.46 11.12,14.25 24.5,14.25 28.88,18.62 28.88,20.75 32.54,24.41 v32.54,24.88
SONAR_ECHO_2  (via drill 0.5)
  Top 0.305: v35.17,24.51 35.17,25.71 35.83,26.37 36.87,26.37 IC1.29
  Bottom 0.305: D2.C 26.88,10.7 RDA3.1 28,10.75 29,11.75 30.25,11.75 30.75,12.25 30.75,15 31.12,15.38 31.12,21.38 33.51,23.76 34.27,23.76 35.02,24.51 v35.17,24.51
SONAR_TRIG_1  (via drill 0.5)
  Top 0.305: IC1.32 35,27.88 33.16,26.03 32.95,25.83 v31.63,25.83
  Bottom 0.305: RDC6.1 8.82,13.82 9.75,14.75 24.12,14.75 28.38,19 28.38,21.12 31.62,24.37 v31.63,25.83
SONAR_TRIG_2  (via drill 0.5)
  Top 0.305: IC1.30 35.62,26.88 33.87,25.12 v33.87,24.68
  Bottom 0.305: RDC2.1 29.7,17.82 30.62,18.75 30.62,21.62 33.68,24.68 v33.87,24.68
SPI_MISO  (via drill 0.5, 0.5 pad 0.3)
  Top 0.305: JP2.3 66.2,46.2 64.62,44.62 62.75,44.62 56.38,38.25 IC2.16 56.38,29.5 55,28.12 v55,27.25 | IC1.27 42.5,25.38 47.5,20.38 50.5,20.38 51.12,19.75 52.46,18.41 v57.02,18.41 59.12,18.41 59.62,17.91 64.23,13.3 64.36,13.17 v64.36,11.05
  Bottom 0.305: JP6.21 76.62,3.77 76.62,5.62 75.5,6.75 70.5,6.75 70.47,6.75 66.55,10.67 66.55,11.3 66.17,11.68 64.99,11.68 64.86,11.56 v64.36,11.05 | v55,27.25 54,26.25 53.98,26.23 53.98,24.51 57.02,21.46 57.02,19.18 v57.02,18.41 | R15.2 67,45.75 66.25,46.5 JP2.3
SPI_MOSI  (via drill 0.5, 0.5 pad 0.3)
  Top 0.305: JP2.2 63.66,46.41 55.88,38.62 IC2.17 55.88,29.88 54.12,28.12 54.12,27.38 | IC1.28 42.75,25.88 47.75,20.88 50.75,20.88 51.38,20.25 52.19,19.43 v56.01,19.43 59.05,19.43 65.53,12.95 65.55,12.95 v65.55,10.73 | 54.12,27.75 54.12,27.38 | 54.12,27.38 54.12,26.75 v53.12,25.75
  Bottom 0.305: JP6.19 74.12,3.73 74.12,5.62 73.5,6.25 69.88,6.25 69.88,6.27 v65.55,10.73 | JP2.2 63.66,45.72 65.12,44.25 R16.2 | v53.12,25.75 53.47,25.41 53.47,24.26 56.01,21.72 v56.01,19.43
SPI_NSS11  (via drill 0.5)
  Top 0.305: IC1.39 34.12,32.12 35.12,33.12 41.62,33.12 43,31.75 43,28.75 v45.38,26.38 | v64.64,15.62 68.75,11.52 v68.75,10.88
  Bottom 0.305: JP6.24 77.72,7.75 71.5,7.75 68.75,10.5 v68.75,10.88 | v45.38,26.38 47.51,24.25 49.75,24.25 50.41,23.59 50.41,22.22 53.5,19.12 53.58,19.05 57,15.62 59.8,12.83 60.33,12.83 63.12,15.62 v64.64,15.62 63.88,15.62
SPI_NSS12  (via drill 0.5)
  Top 0.305: IC1.40 33.62,32.5 42,40.88 v48.38,40.88 | JP1.1 75.38,32.32 70.23,37.47 67.82,37.47 67.44,37.08 61.72,37.08 61.65,37.01 v61.63,37.01
  Bottom 0.305: v61.63,37.01 60.88,36.25 59,36.25 57.25,38 53,38 52.88,38 50.75,38 50.62,38 50.5,38 48.38,40.12 v48.38,40.88
SPI_NSS13  (via drill 0.5)
  Top 0.305: IC1.41 33.12,32.75 42.25,41.88 v47.62,41.88 | 73.5,30.38 73.59,30.28 | 73.59,30.28 75.28,28.59 JP1.2 | v62.5,36.12 67.24,36.12 68.07,36.96 69.72,36.96 70.61,36.07 70.61,33.27 73.66,30.23 73.65,30.23 73.59,30.28
  Bottom 0.305: v47.62,41.88 47.62,40 50.12,37.5 52.12,37.5 52.75,37.5 57,37.5 58.75,35.75 61.88,35.75 62.13,35.75 v62.5,36.12
SPI_NSS21  (via drill 0.5)
  Top 0.305: IC2.31 48.88,28 48.62,27.75 v48.62,27.5 | v70.44,29.3 70.88,28.86 70.88,21.88 70.88,21.85 70.87,21.84 72.01,20.7 82.04,20.7 v83.49,19.25 v83.5,19.25
  Bottom 0.305: v83.5,19.25 83.5,19 84.25,18.25 84.25,12.12 83.12,11 83.12,5.16 JP6.26 | v48.62,27.5 53.62,27.5 54.88,28.75 59,28.75 59.62,29.38 59.62,31.38 60.5,32.25 67.49,32.25 v70.44,29.3
SPI_NSS22  (via drill 0.5)
  Top 0.305: IC2.32 51.88,27.5 52.25,27.88 52.25,29.38 54.25,31.38 v54.25,31.5
  Bottom 0.305: JP3.1 73.38,27.73 73.38,29.88 72.12,31.12 72.12,32.5 71.38,33.25 56,33.25 v54.25,31.5
SPI_NSS23  (via drill 0.5)
  Top 0.305: IC2.33 52.5,27 52.88,27.38 52.88,29.25 54.25,30.62 v55,30.62 | JP3.2 74.07,23.19 73.06,24.19 73.06,28.81 v69.5,32.38
  Bottom 0.305: v69.5,32.38 69.12,32.75 57.12,32.75 v55,30.62
SPI_SCK  (via drill 0.5)  (1 unrouted)
  Top 0.305: JP2.4 68.74,46.37 66.5,44.12 63.12,44.12 56.88,37.88 IC2.15 56.88,29.62 56.88,28 v56.62,27.75 | IC1.26 42.25,24.88 47.25,19.88 50.25,19.88 50.88,19.25 52.6,17.53 v58.17,17.53 59.05,17.53 59.18,17.4 60.2,16.38 63.25,13.34 63.35,13.23 v63.35,11.85
  Bottom 0.305: JP6.23 79.12,3.81 79.12,5.62 77.5,7.25 71,7.25 67.31,10.94 67.31,11.43 66.48,12.26 63.75,12.26 | v56.62,27.75 54.5,25.62 54.48,25.61 54.48,24.77 58.04,21.21 58.04,18.29 58.04,17.65 v58.17,17.53 | R14.2 JP2.4 | v63.35,11.85 63.75,12.26
SWCLK
  Bottom 0.305: JP7.3 49.88,7.89 JP8.2
SWCLK1  (via drill 0.5)
  Top 0.305: IC1.37 35.12,32.38 35.38,32.62 41.38,32.62 42.5,31.5 42.5,27.69 v41.62,26.82 | v41.62,24 42.38,24 48.62,17.75 48.62,12.5 47.34,11.21 JP8.1
  Bottom 0.305: v41.62,26.82 v41.62,24
SWCLK2  (via drill 0.5)
  Top 0.305: JP8.3 55.56,11 57.12,12.57 59.05,14.5 59.18,14.62 v59.18,14.73 | v52.37,22.61 52.38,22.4 IC2.37
  Bottom 0.305: v52.37,22.61 52.37,21.75 54.62,19.5 57.49,16.64 58.66,16.64 59.18,16.12 59.18,15.62 | 59.18,15.62 v59.18,14.73 | 59.18,15.88 59.18,15.62
SWDIO
  Bottom 0.305: JP12.2 51.12,13 51.12,9.12 52.38,7.88 JP7.2
SWDIO1  (via drill 0.5)
  Top 0.305: JP12.1 47.34,18.29 42.5,23.12 40.88,23.12 v40.5,22.75 | IC1.34 37.5,28.88 v38.62,27.75
  Bottom 0.305: v40.5,22.75 38.5,22.75 38,23.25 38,27.12 v38.62,27.75
SWDIO2  (via drill 0.5, 0.5 pad 0.3)
  Top 0.305: IC2.34 49.12,26.5 v48.62,26 | JP12.3 53.19,13.35 54.04,12.5 55.75,12.5 58.04,14.79 58.29,15.04 v58.29,15.62
  Bottom 0.305: v48.62,26 48.68,25.95 49.44,25.95 50.92,24.47 50.92,22.45 53.88,19.5 55.1,18.27 57.75,15.62 v58.29,15.62
SWITCH1  (via drill 0.6)
  Top 0.305: v55,34.75 55,34.38 55.38,34 IC2.18
  Bottom 0.305: CS2.2 RS2.1 82.83,25.18 81.5,26.5 78.12,26.5 77.25,27.38 77.25,29 76.38,29.88 74.12,29.88 72.62,31.38 72.62,32.75 71.62,33.75 57.88,33.75 56.88,34.75 v55,34.75
SWITCH2  (via drill 0.5)
  Top 0.305: v54.5,36.75 54.38,36.62 54.12,36.38 54.12,34.5 54.25,34.38 54.88,33.75 IC2.19
  Bottom 0.305: RS1.1 CS1.2 82.83,34.58 82,33.75 77.75,33.75 74.12,33.75 72.62,35.25 58.5,35.25 57,36.75 v54.5,36.75
SWITCH3  (via drill 0.5)
  Top 0.305: v55.25,39.88 55,39.88 53.62,38.5 53.62,34.38 54.38,33.62 IC2.20 | v76.13,45.56 76.11,45.55 75.39,45.55 72.71,42.88 72.51,42.67 68.83,42.67 68.42,42.67 64.38,38.62 v59.88,38.62
  Bottom 0.305: CS3.2 RS3.1 79.7,53.83 78.75,52.88 78.75,48.5 76.13,45.88 v76.13,45.56 | v55.25,39.88 55.62,39.5 58.88,39.5 59,39.5 v59.88,38.62
SWITCH4  (via drill 0.5)
  Top 0.305: IC2.39 53.38,22.25 52.88,21.75 52,21.75 51.38,22.38 48.5,22.38 47.38,23.5 47.38,27.88 44.88,30.38 44.88,31.5 47.38,34 47.38,36.88 | 47.38,36.88 47.4,36.88 50.26,39.73 50.26,42.33 51.01,43.13 52.95,43.13 53.81,43.13 v54.15,42.78 | 47.38,36.88 47.49,36.99 47.52,36.99 | v62.62,41.25 64.38,41.25 67.56,44.44 67.56,44.45 71.95,44.45 72.12,44.62 73.21,45.71 v73.21,46.7
  Bottom 0.305: RS4.1 CS4.2 71.55,53.83 72.5,52.88 72.5,47.41 v73.21,46.7 | v62.62,41.25 62,41.25 61.12,42.12 60.88,42.38 60.62,42.38 54.56,42.38 v54.15,42.78
SWITCH5  (via drill 0.5)
  Top 0.305: IC2.40 53.88,22 53.12,21.25 51.88,21.25 51.25,21.88 48.25,21.88 46.88,23.25 46.88,27.5 44.12,30.25 44.12,31.5 46.88,34.25 46.88,37.25 49.8,40.17 49.8,42.62 49.93,42.75 50.8,43.62 54.55,43.62 56.17,43.62 56.55,43.62 v56.91,43.26
  Bottom 0.305: RS5.1 CS5.2 57.55,53.83 57.55,53.7 58.5,52.75 58.5,45.25 58.5,44.85 v56.91,43.26
SWITCH6  (via drill 0.5)
  Top 0.305: IC2.41 54.38,21.75 53.38,20.75 51.62,20.75 51,21.38 48,21.38 46.38,23 46.38,26.75 43.5,29.62 43.5,31.62 46.38,34.5 46.38,37.5 49.25,40.38 49.25,43.03 v48.95,43.33
  Bottom 0.305: RS6.1 42.25,53.7 CS6.2 44.92,53.7 46.38,52.25 46.38,45.25 48.12,43.5 48.29,43.33 v48.95,43.33
TRIG1
  Bottom 0.305: SS1.P$3 8,6.38 7.12,7.25 7.12,8.12 | 2N7002A5.1 7.56,8.56 7.12,8.12 | RDA10.1 7.09,8.1 7.12,8.12
TRIG2
  Bottom 0.305: 22,7.62 22,8.07 | 22,8.07 RDA1.1 22.31,8.73 | 2N7002A1.1 22.87,8.25 22.75,8.25 | 22.75,8.25 22.12,8.25 | 22.12,8.25 22,8.25 | SS2.P$3 22.75,7.62 22.75,8.25 | 22,8.07 22.12,8.2 22.12,8.25
USART1_RX
  Top 0.305: JP5.3 39.48,40.6 32.12,33.25 IC1.43
USART1_TX
  Top 0.305: IC1.42 32.62,33 34.25,34.62 42.02,42.4 42.02,42.6 JP5.2
USART2_RX  (via drill 0.5)
  Top 0.305: IC2.13 57.88,38 61.75,41.88 62.25,42.38 v62.75,42.38 | USART.3 52.02,45.15 53.05,44.12 57.5,44.12 58.88,44.12 v59.5,43.5
  Bottom 0.305: v62.75,42.38 61.62,43.5 v59.5,43.5
USART2_TX  (via drill 0.5)
  Top 0.305: IC2.12 59.62,36.88 60.62,37.88 65.62,37.88 v68.62,40.88 | v60.12,44.62 56.13,44.62 55.88,44.62 | 56.12,44.62 55.88,44.62 | 55.88,44.62 55.23,44.62 54.57,45.29 USART.2 | USART.2
  Bottom 0.305: v60.12,44.62 61.88,44.62 63.75,42.75 63.75,41.62 64.25,41.12 64.5,40.88 v68.62,40.88
VCC
  Top 0.305: RSTM5.1 75.95,11.68 75.25,12.38 74.12,12.38 73.38,13.12 73.38,15.12 74.38,16.12 75.38,16.12 JP11.2
  Bottom 0.305: RSTM1.2 RSTM1A.2 | RSTM2.2 RP.2 RSTM1.2 | RSTM1.2 69.8,17.72 C19.2 71.86,18.46 C10.+ | C10.+ 73.3,19.02 | JP11.2 73.06,18.46 C10.+
VDD  (via drill 0.5)
  Top 0.305: 27.62,31.62 27.12,31.12 27.12,30.12 27.38,29.88 IC1.1 28.63,29.88 28.96,29.54 28.96,28.79 29.76,28 30.88,28 32.75,29.88 IC1.36 37.62,29.88 39.09,31.34 C7.1 40.66,31.34 v40.75,31.25 | 27.62,31.62 28.18,31.62 C9.1 | 36.5,22.59 C8.1 | RDB1.2 16.61,13.22 Q3.2 18.48,13.22 19.38,14.12 19.38,21.88 U$5.P$1 | JP5.4 37,46.5 39.4,48.9 58.7,48.9 59.18,49.38 v60.62,49.38 | 27.62,31.62 27.62,31.75 | IC1.48 28.34,31.62 C9.1 | v40,34.25 41,34.25 R5.1 | v76.88,21.88 77.6,22.6 77.6,24.35 77.6,33.1 JP9.4 69.75,40.95 v69.75,41.38 | IC1.24 35.12,23.25 35.38,23.5 36.29,23.5 v36.37,23.42 36.38,23.4 C8.1 | 36.37,22.44 C8.1 | v25.38,37.38 25.38,32.92 26.8,31.5 27.36,31.5 | 27.36,31.5 27.38,31.52 | 27.36,31.5 27.36,31.44 C9.1
  Bottom 0.305: U$5.P$1 16,25.25 16,32.12 17.38,33.5 U$6.P$1 19.13,34.76 22.77,34.76 23.75,35.74 23.75,35.75 v25.38,37.38 25.38,43.38 | 61.12,47 JP2.1 | 61.12,47 61.12,48.88 v60.62,49.38 | JP5.4 35.88,47.56 35.88,53.88 35.38,54.38 28.62,54.38 U$4.P$1 27.75,53.5 26.75,53.5 25.88,52.62 25.86,52.62 25.4,52.17 25.38,52.14 25.38,43.38 | U$3.P$1 25.45,43.45 25.38,43.38 | v40,34.25 40.75,33.5 40.75,33.12 v40.75,31.25 36.62,27.12 36.37,26.87 v36.37,23.42 | RSTM1.1 68.25,17.5 68.62,17.88 68.62,21.25 68.62,21.62 68.88,21.88 74.5,21.88 v76.88,21.88 | v69.75,41.38 69.25,41.75 68.75,42.25 R14.1 R15.1 66.98,42.31 R16.1 61.12,46.36 61.12,47
VDDA  (via drill 0.5)
  Top 0.305: v45.57,17.89 35.59,17.89 L1.2
  Bottom 0.305: RSTM1A.1 68.25,15.88 68.62,15.5 68.62,13.38 68.2,12.95 68.07,12.83 63,12.83 62.37,12.21 62.37,11.17 61.83,10.62 59.75,10.62 53,17.38 46.09,17.38 v45.57,17.89
VEE  (via drill 0.5)
  Top 0.305: IC2.48 57.88,24.25 58.12,24.5 | 58.12,24.5 58.88,24.5 | 58.88,24.5 59.12,24.25 C20.1 59.55,23.45 59.55,23.07 v60.62,22 | IC2.36 51.25,25.5 51.5,25.25 51.5,24.68 51.5,24.62 51.25,24.38 50.5,24.38 | IC2.1 59.12,25.5 58.88,25.25 58.88,24.5 | N6.P$1 44.62,50.5 45.5,51.38 56,51.38 N5.P$1 58.5,51.38 68.62,51.38 N4.P$1 71.12,51.38 81.25,51.38 N3.P$1 82.5,38.62 N2.P$1 79.12,35.12 82.38,31.88 82.55,31.7 82.55,26.16 81.32,24.93 R_LED7.2 81.09,24.59 N1.P$1 | 58.12,24.5 58.25,24.62 v58.25,25.38 | 50.45,24.32 C14.1 | C21.1 51.67,34.2 | 51.67,34.2 52.38,33.5 IC2.24 | 51.67,34.2 51.25,34.62 51.25,35.38 v51.12,35.5 | v49.5,23.12 49.5,23.43 C14.1 | USART.4 49.49,45.49 v46.88,42.88 | 50.5,24.38 C14.1 | C14.1 50.38,24.38 | C14.1 50.5,24.38
  Bottom 0.305: CS6.1 N6.P$1 | CS4.1 N4.P$1 | CS3.1 N3.P$1 | CS1.1 N2.P$1 | CS2.1 N1.P$1 77.25,24.5 76,24.5 70.75,24.5 69,22.75 67.67,21.43 | CS5.1 N5.P$1 57.25,49.38 56.5,48.62 50.25,48.62 49.49,47.87 USART.4 | RSTM2.1 67.67,21.43 | 67.67,21.43 61.58,21.43 61.2,21.43 v60.62,22 | v46.88,42.88 46.88,39.75 v51.12,35.5 | v49.5,23.12 49.5,22.38 53.38,18.5 53.39,18.48 56.75,15.13 56.76,15.11 56.77,15.11 57.15,14.73 59.56,12.32 60.58,12.32 62.99,14.73 65.15,14.73 65.91,15.49 65.91,16.26 65.91,17.4 63.75,19.56 59.69,19.56 59.05,20.19 59.05,24.57 v58.25,25.38
VEEA  (via drill 0.5)
  Top 0.305: L2.2 65.61,19.12 v66.5,19.12
  Bottom 0.305: 67.75,19.12 RP.1 v66.5,19.12
VPP
  Top 0.305: JP7.4 47.31,5.68 51.88,1.12 83.62,1.12 84.38,1.88 84.38,11 81.63,13.74 75.52,13.74 75.4,13.62 75.39,13.62 JP11.1

## Text on the board
tPlace: VDDA | DIODE2 | PHOTO2 | IR2 | Noga3 | Noga2 | Noga4 | VDDA | Noga5 | I2C | DIODE1 | PHOTO1 | GND | Noga6 | SERW | LED6 | SW6 | VEE | SERW | LED5 | SW5 | VEE | SERW | LED4 | SW4 | VEE | SDA | IR1 | SPI | SCL | UART1 | VDD | RX | TX | GND | UART2 | VDD | RX | TX | GND | VDD | MOSI | MISO | SCK | GND | VDD | VDDA | STM2 | DIODE4 | STM1 | PHOTO4 | SPI | Noga1 | IR4 | NSS12 | SERW | NSS13 | LED1 | NSS22 | SW1 | VDDA | NSS23 | VEE | DIODE3 | PHOTO3 | ZAS | ZWOR | IR3 | SWDIO1 | SWDIO | SWDIO2 | 3.3V | GND | VCC | 3.3V | STM1 | SWCLK1 | SWCLK | SWCLK2 | STM2 | PROG | VPP | 5V | 15V | Serw / Analog | 5V | GND | SERW | IMU | VPP | SWCLK | SWDIO | GND | 5V | TX | RX | GND | 3.3V | Sonar2 | 5V | GND | TRIG2 | ECHO2 | SHARP2 | 5V | 5V | GND | TRIG1 | ECHO1 | SHARP1 | Sonar1 | 15V | RPI